# Altium schematic sheet 20_FPGA_Power.SchDoc: FPGA power
size A3; Organization: Lime Microsystems; Address1: Surrey Tech Centre; Address2: Guildford GU2 7YG; Address3: Surrey; Address4: United Kingdom; Revision: v1.0; SheetNumber: 20; SheetTotal: 31
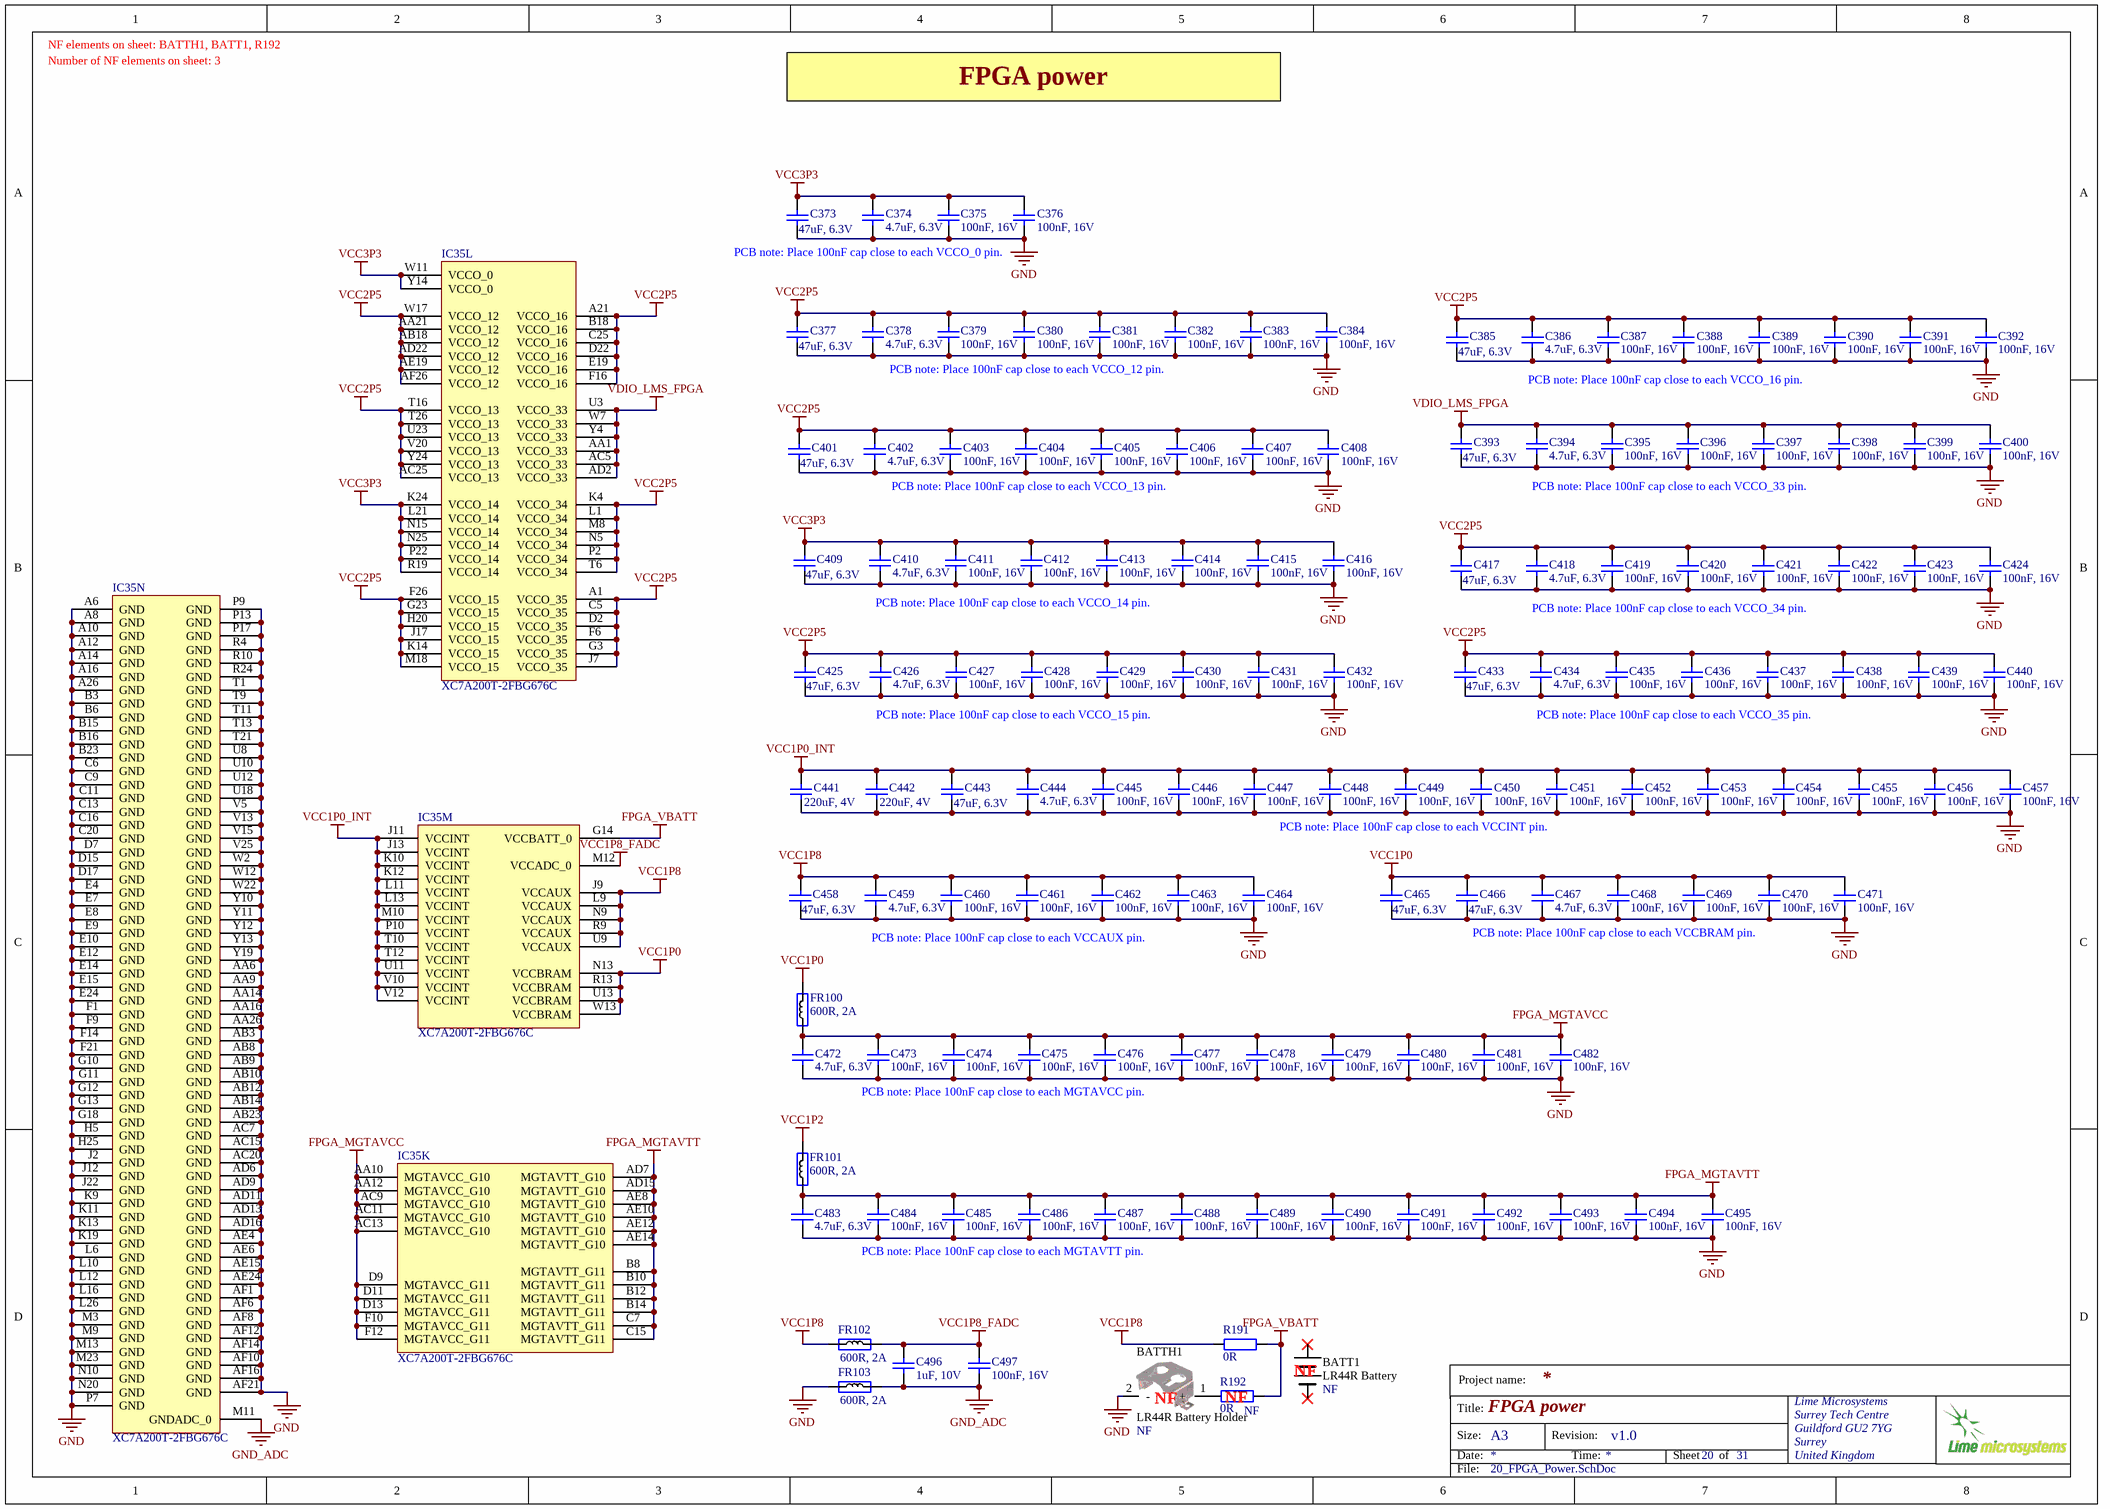
[diagram p0: 20_FPGA_Power.SchDoc]

## Parts
BATT1  LR44R Battery  Assembly Info: NF  (mechanical)
BATTH1  LR44R Battery Holder  Assembly Info: NF  [LR44R_BATTERY_HOLDER]
C373  47uF, 6.3V  [CAP1206]
C374  4.7uF, 6.3V  [CAP0402]
C375  100nF, 16V  [CAP0402]
C376  100nF, 16V  [CAP0402]
C377  47uF, 6.3V  [CAP1206]
C378  4.7uF, 6.3V  [CAP0402]
C379  100nF, 16V  [CAP0402]
C380  100nF, 16V  [CAP0402]
C381  100nF, 16V  [CAP0402]
C382  100nF, 16V  [CAP0402]
C383  100nF, 16V  [CAP0402]
C384  100nF, 16V  [CAP0402]
C385  47uF, 6.3V  [CAP1206]
C386  4.7uF, 6.3V  [CAP0402]
C387  100nF, 16V  [CAP0402]
C388  100nF, 16V  [CAP0402]
C389  100nF, 16V  [CAP0402]
C390  100nF, 16V  [CAP0402]
C391  100nF, 16V  [CAP0402]
C392  100nF, 16V  [CAP0402]
C393  47uF, 6.3V  [CAP1206]
C394  4.7uF, 6.3V  [CAP0402]
C395  100nF, 16V  [CAP0402]
C396  100nF, 16V  [CAP0402]
C397  100nF, 16V  [CAP0402]
C398  100nF, 16V  [CAP0402]
C399  100nF, 16V  [CAP0402]
C400  100nF, 16V  [CAP0402]
C401  47uF, 6.3V  [CAP1206]
C402  4.7uF, 6.3V  [CAP0402]
C403  100nF, 16V  [CAP0402]
C404  100nF, 16V  [CAP0402]
C405  100nF, 16V  [CAP0402]
C406  100nF, 16V  [CAP0402]
C407  100nF, 16V  [CAP0402]
C408  100nF, 16V  [CAP0402]
C409  47uF, 6.3V  [CAP1206]
C410  4.7uF, 6.3V  [CAP0402]
C411  100nF, 16V  [CAP0402]
C412  100nF, 16V  [CAP0402]
C413  100nF, 16V  [CAP0402]
C414  100nF, 16V  [CAP0402]
C415  100nF, 16V  [CAP0402]
C416  100nF, 16V  [CAP0402]
C417  47uF, 6.3V  [CAP1206]
C418  4.7uF, 6.3V  [CAP0402]
C419  100nF, 16V  [CAP0402]
C420  100nF, 16V  [CAP0402]
C421  100nF, 16V  [CAP0402]
C422  100nF, 16V  [CAP0402]
C423  100nF, 16V  [CAP0402]
C424  100nF, 16V  [CAP0402]
C425  47uF, 6.3V  [CAP1206]
C426  4.7uF, 6.3V  [CAP0402]
C427  100nF, 16V  [CAP0402]
C428  100nF, 16V  [CAP0402]
C429  100nF, 16V  [CAP0402]
C430  100nF, 16V  [CAP0402]
C431  100nF, 16V  [CAP0402]
C432  100nF, 16V  [CAP0402]
C433  47uF, 6.3V  [CAP1206]
C434  4.7uF, 6.3V  [CAP0402]
C435  100nF, 16V  [CAP0402]
C436  100nF, 16V  [CAP0402]
C437  100nF, 16V  [CAP0402]
C438  100nF, 16V  [CAP0402]
C439  100nF, 16V  [CAP0402]
C440  100nF, 16V  [CAP0402]
C441  220uF, 4V  [CAP1206]
C442  220uF, 4V  [CAP1206]
C443  47uF, 6.3V  [CAP1206]
C444  4.7uF, 6.3V  [CAP0402]
C445  100nF, 16V  [CAP0402]
C446  100nF, 16V  [CAP0402]
C447  100nF, 16V  [CAP0402]
C448  100nF, 16V  [CAP0402]
C449  100nF, 16V  [CAP0402]
C450  100nF, 16V  [CAP0402]
C451  100nF, 16V  [CAP0402]
C452  100nF, 16V  [CAP0402]
C453  100nF, 16V  [CAP0402]
C454  100nF, 16V  [CAP0402]
C455  100nF, 16V  [CAP0402]
C456  100nF, 16V  [CAP0402]
C457  100nF, 16V  [CAP0402]
C458  47uF, 6.3V  [CAP1206]
C459  4.7uF, 6.3V  [CAP0402]
C460  100nF, 16V  [CAP0402]
C461  100nF, 16V  [CAP0402]
C462  100nF, 16V  [CAP0402]
C463  100nF, 16V  [CAP0402]
C464  100nF, 16V  [CAP0402]
C465  47uF, 6.3V  [CAP1206]
C466  47uF, 6.3V  [CAP1206]
C467  4.7uF, 6.3V  [CAP0402]
C468  100nF, 16V  [CAP0402]
C469  100nF, 16V  [CAP0402]
C470  100nF, 16V  [CAP0402]
C471  100nF, 16V  [CAP0402]
C472  4.7uF, 6.3V  [CAP0402]
C473  100nF, 16V  [CAP0402]
C474  100nF, 16V  [CAP0402]
C475  100nF, 16V  [CAP0402]
C476  100nF, 16V  [CAP0402]
C477  100nF, 16V  [CAP0402]
C478  100nF, 16V  [CAP0402]
C479  100nF, 16V  [CAP0402]
C480  100nF, 16V  [CAP0402]
C481  100nF, 16V  [CAP0402]
C482  100nF, 16V  [CAP0402]
C483  4.7uF, 6.3V  [CAP0402]
C484  100nF, 16V  [CAP0402]
C485  100nF, 16V  [CAP0402]
C486  100nF, 16V  [CAP0402]
C487  100nF, 16V  [CAP0402]
C488  100nF, 16V  [CAP0402]
C489  100nF, 16V  [CAP0402]
C490  100nF, 16V  [CAP0402]
C491  100nF, 16V  [CAP0402]
C492  100nF, 16V  [CAP0402]
C493  100nF, 16V  [CAP0402]
C494  100nF, 16V  [CAP0402]
C495  100nF, 16V  [CAP0402]
C496  1uF, 10V  [CAP0402]
C497  100nF, 16V  [CAP0402]
FR100  600R, 2A  [RES0805]
FR101  600R, 2A  [RES0805]
FR102  600R, 2A  [RES0805]
FR103  600R, 2A  [RES0805]
IC35  XC7A200T-2FBG676C  [XC7A200T-2FBG676C_FBG676]  (parts K,L,M,N of 14)
R191  0R  [RES0402]
R192  0R  Assembly Info: NF  [RES0402]

## Nets
FPGA_MGTAVCC: C472.2 C473.1 C474.1 C475.1 C476.1 C477.1 C478.1 C479.1 C480.1 C481.1 C482.1 FR100.1 IC35.AA10(MGTAVCC_G10) IC35.AA12(MGTAVCC_G10) IC35.AC9(MGTAVCC_G10) IC35.AC11(MGTAVCC_G10) IC35.AC13(MGTAVCC_G10) IC35.D9(MGTAVCC_G11) IC35.D11(MGTAVCC_G11) IC35.D13(MGTAVCC_G11) IC35.F10(MGTAVCC_G11) IC35.F12(MGTAVCC_G11)
FPGA_MGTAVTT: C483.2 C484.1 C485.1 C486.1 C487.1 C488.1 C489.1 C490.1 C491.1 C492.1 C493.1 C494.1 C495.1 FR101.1 IC35.AD7(MGTAVTT_G10) IC35.AD15(MGTAVTT_G10) IC35.AE8(MGTAVTT_G10) IC35.AE10(MGTAVTT_G10) IC35.AE12(MGTAVTT_G10) IC35.AE14(MGTAVTT_G10) IC35.B8(MGTAVTT_G11) IC35.B10(MGTAVTT_G11) IC35.B12(MGTAVTT_G11) IC35.B14(MGTAVTT_G11) IC35.C7(MGTAVTT_G11) IC35.C15(MGTAVTT_G11)
FPGA_VBATT: IC35.G14(VCCBATT_0) R191.2 R192.2
GND: BATTH1.2(-) C373.1 C374.1 C375.2 C376.2 C377.1 C378.1 C379.2 C380.2 C381.2 C382.2 C383.2 C384.2 C385.1 C386.1 C387.2 C388.2 C389.2 C390.2 C391.2 C392.2 C393.1 C394.1 C395.2 C396.2 C397.2 C398.2 C399.2 C400.2 C401.1 C402.1 C403.2 C404.2 C405.2 C406.2 C407.2 C408.2 C409.1 C410.1 C411.2 C412.2 C413.2 C414.2 C415.2 C416.2 C417.1 C418.1 C419.2 C420.2 C421.2 C422.2 C423.2 C424.2 C425.1 C426.1 C427.2 C428.2 C429.2 C430.2 C431.2 C432.2 C433.1 C434.1 C435.2 C436.2 C437.2 C438.2 C439.2 C440.2 C441.1 C442.1 C443.1 C444.1 C445.2 C446.2 C447.2 C448.2 C449.2 C450.2 C451.2 C452.2 C453.2 C454.2 C455.2 C456.2 C457.2 C458.1 C459.1 C460.2 C461.2 C462.2 C463.2 C464.2 C465.1 C466.1 C467.1 C468.2 C469.2 C470.2 C471.2 C472.1 C473.2 C474.2 C475.2 C476.2 C477.2 C478.2 C479.2 C480.2 C481.2 C482.2 C483.1 C484.2 C485.2 C486.2 C487.2 C488.2 C489.2 C490.2 C491.2 C492.2 C493.2 C494.2 C495.2 FR103.1 IC35.A6(GND) IC35.A8(GND) IC35.A10(GND) IC35.A12(GND) IC35.A14(GND) IC35.A16(GND) IC35.A26(GND) IC35.AA6(GND) IC35.AA9(GND) IC35.AA14(GND) IC35.AA16(GND) IC35.AA26(GND) IC35.AB3(GND) IC35.AB8(GND) IC35.AB9(GND) IC35.AB10(GND) IC35.AB12(GND) IC35.AB14(GND) IC35.AB23(GND) IC35.AC7(GND) IC35.AC15(GND) IC35.AC20(GND) IC35.AD6(GND) IC35.AD9(GND) IC35.AD11(GND) IC35.AD13(GND) IC35.AD16(GND) IC35.AE4(GND) IC35.AE6(GND) IC35.AE15(GND) IC35.AE24(GND) IC35.AF1(GND) IC35.AF6(GND) IC35.AF8(GND) IC35.AF10(GND) IC35.AF12(GND) IC35.AF14(GND) IC35.AF16(GND) IC35.AF21(GND) IC35.B3(GND) IC35.B6(GND) IC35.B15(GND) IC35.B16(GND) IC35.B23(GND) IC35.C6(GND) IC35.C9(GND) IC35.C11(GND) IC35.C13(GND) IC35.C16(GND) IC35.C20(GND) IC35.D7(GND) IC35.D15(GND) IC35.D17(GND) IC35.E4(GND) IC35.E7(GND) IC35.E8(GND) IC35.E9(GND) IC35.E10(GND) IC35.E12(GND) IC35.E14(GND) IC35.E15(GND) IC35.E24(GND) IC35.F1(GND) IC35.F9(GND) IC35.F14(GND) IC35.F21(GND) IC35.G10(GND) IC35.G11(GND) IC35.G12(GND) IC35.G13(GND) IC35.G18(GND) IC35.H5(GND) IC35.H25(GND) IC35.J2(GND) IC35.J12(GND) IC35.J22(GND) IC35.K9(GND) IC35.K11(GND) IC35.K13(GND) IC35.K19(GND) IC35.L6(GND) IC35.L10(GND) IC35.L12(GND) IC35.L16(GND) IC35.L26(GND) IC35.M3(GND) IC35.M9(GND) IC35.M13(GND) IC35.M23(GND) IC35.N10(GND) IC35.N20(GND) IC35.P7(GND) IC35.P9(GND) IC35.P13(GND) IC35.P17(GND) IC35.R4(GND) IC35.R10(GND) IC35.R24(GND) IC35.T1(GND) IC35.T9(GND) IC35.T11(GND) IC35.T13(GND) IC35.T21(GND) IC35.U8(GND) IC35.U10(GND) IC35.U12(GND) IC35.U18(GND) IC35.V5(GND) IC35.V13(GND) IC35.V15(GND) IC35.V25(GND) IC35.W2(GND) IC35.W12(GND) IC35.W22(GND) IC35.Y10(GND) IC35.Y11(GND) IC35.Y12(GND) IC35.Y13(GND) IC35.Y19(GND)
GND_ADC: C496.1 C497.2 FR103.2 IC35.M11(GNDADC_0)
VCC1P0: C465.2 C466.2 C467.2 C468.1 C469.1 C470.1 C471.1 FR100.2 IC35.N13(VCCBRAM) IC35.R13(VCCBRAM) IC35.U13(VCCBRAM) IC35.W13(VCCBRAM)
VCC1P0_INT: C441.2 C442.2 C443.2 C444.2 C445.1 C446.1 C447.1 C448.1 C449.1 C450.1 C451.1 C452.1 C453.1 C454.1 C455.1 C456.1 C457.1 IC35.J11(VCCINT) IC35.J13(VCCINT) IC35.K10(VCCINT) IC35.K12(VCCINT) IC35.L11(VCCINT) IC35.L13(VCCINT) IC35.M10(VCCINT) IC35.P10(VCCINT) IC35.T10(VCCINT) IC35.T12(VCCINT) IC35.U11(VCCINT) IC35.V10(VCCINT) IC35.V12(VCCINT)
VCC1P2: FR101.2
VCC1P8: C458.2 C459.2 C460.1 C461.1 C462.1 C463.1 C464.1 FR102.1 IC35.J9(VCCAUX) IC35.L9(VCCAUX) IC35.N9(VCCAUX) IC35.R9(VCCAUX) IC35.U9(VCCAUX) R191.1
VCC1P8_FADC: C496.2 C497.1 FR102.2 IC35.M12(VCCADC_0)
VCC2P5: C377.2 C378.2 C379.1 C380.1 C381.1 C382.1 C383.1 C384.1 C385.2 C386.2 C387.1 C388.1 C389.1 C390.1 C391.1 C392.1 C401.2 C402.2 C403.1 C404.1 C405.1 C406.1 C407.1 C408.1 C417.2 C418.2 C419.1 C420.1 C421.1 C422.1 C423.1 C424.1 C425.2 C426.2 C427.1 C428.1 C429.1 C430.1 C431.1 C432.1 C433.2 C434.2 C435.1 C436.1 C437.1 C438.1 C439.1 C440.1 IC35.A1(VCCO_35) IC35.A21(VCCO_16) IC35.AA21(VCCO_12) IC35.AB18(VCCO_12) IC35.AC25(VCCO_13) IC35.AD22(VCCO_12) IC35.AE19(VCCO_12) IC35.AF26(VCCO_12) IC35.B18(VCCO_16) IC35.C5(VCCO_35) IC35.C25(VCCO_16) IC35.D2(VCCO_35) IC35.D22(VCCO_16) IC35.E19(VCCO_16) IC35.F6(VCCO_35) IC35.F16(VCCO_16) IC35.F26(VCCO_15) IC35.G3(VCCO_35) IC35.G23(VCCO_15) IC35.H20(VCCO_15) IC35.J7(VCCO_35) IC35.J17(VCCO_15) IC35.K4(VCCO_34) IC35.K14(VCCO_15) IC35.L1(VCCO_34) IC35.M8(VCCO_34) IC35.M18(VCCO_15) IC35.N5(VCCO_34) IC35.P2(VCCO_34) IC35.T6(VCCO_34) IC35.T16(VCCO_13) IC35.T26(VCCO_13) IC35.U23(VCCO_13) IC35.V20(VCCO_13) IC35.W17(VCCO_12) IC35.Y24(VCCO_13)
VCC3P3: C373.2 C374.2 C375.1 C376.1 C409.2 C410.2 C411.1 C412.1 C413.1 C414.1 C415.1 C416.1 IC35.K24(VCCO_14) IC35.L21(VCCO_14) IC35.N15(VCCO_14) IC35.N25(VCCO_14) IC35.P22(VCCO_14) IC35.R19(VCCO_14) IC35.W11(VCCO_0) IC35.Y14(VCCO_0)
VDIO_LMS_FPGA: C393.2 C394.2 C395.1 C396.1 C397.1 C398.1 C399.1 C400.1 IC35.AA1(VCCO_33) IC35.AC5(VCCO_33) IC35.AD2(VCCO_33) IC35.U3(VCCO_33) IC35.W7(VCCO_33) IC35.Y4(VCCO_33)
NetBATTH1_1: BATTH1.1(+) R192.1

Not connected (* = marked no-connect by the designer): BATT1 NEGATIVE* POSITIVE*

## Notes on the sheet
- NF elements on sheet: BATTH1, BATT1, R192
- Number of NF elements on sheet: 3
- FPGA power
- PCB note: Place 100nF cap close to each VCCO_0 pin.
- PCB note: Place 100nF cap close to each VCCO_12 pin.
- PCB note: Place 100nF cap close to each VCCO_16 pin.
- PCB note: Place 100nF cap close to each VCCO_13 pin.
- PCB note: Place 100nF cap close to each VCCO_33 pin.
- PCB note: Place 100nF cap close to each VCCO_14 pin.
- PCB note: Place 100nF cap close to each VCCO_34 pin.
- PCB note: Place 100nF cap close to each VCCO_15 pin.
- PCB note: Place 100nF cap close to each VCCO_35 pin.
- PCB note: Place 100nF cap close to each VCCINT pin.
- PCB note: Place 100nF cap close to each VCCAUX pin.
- PCB note: Place 100nF cap close to each VCCBRAM pin.
- PCB note: Place 100nF cap close to each MGTAVCC pin.
- PCB note: Place 100nF cap close to each MGTAVTT pin.
- (near BATT1) NF
- (near BATTH1) NF
- (near R192) NF
- Project name:
- Title:
- Size:
- Date:
- A3
- Revision:
- Time:
- Sheet
- of
- File:

## Library data of the parts
BATT1 = LR44R_BATTERY: Part Description: Coin, 11.6mm Alkaline Manganese Dioxide 1.5 V Battery Non-Rechargeable (Primary); Manufacturer: Murata; ComponentLink1URL: http://na.industrial.panasonic.com/sites/default/pidsa/files/crseries_datasheets_merged.pdf; ComponentLink1Description: http://na.industrial.panasonic.com/sites/default/pidsa/files/crseries_datasheets_merged.pdf; Supplier 1: DigiKey; Supplier Part Number 1: 490-LR44R-ND; Manufacturer Part Number 1: LR44R; Stock 1: 1754; Pricing 1: 1=0,71000, 10=0,59200, 50=0,51660, 100=0,48880, 250=0,45272, 500=0,42774, 1000=0,40274, 2500=0,37496, 5000=0,35552 (USD)
BATTH1 = LR44R_BATTERY_HOLDER: Part Description: Battery Retainer Coin, 11.6mm 1 Cell SMD (SMT) Tab; Manufacturer: Keystone Electronics; Manufacturer Part Number 1: 2996; Number of Batteries: 1; ComponentLink1URL: http://na.industrial.panasonic.com/sites/default/pidsa/files/crseries_datasheets_merged.pdf; ComponentLink1Description: http://na.industrial.panasonic.com/sites/default/pidsa/files/crseries_datasheets_merged.pdf; Supplier 1: Digi-Key; Supplier Part Number 1: 36-2996-ND; Stock 1: 11716; Pricing 1: 1=0,39000, 25=0,32720, 100=0,27070, 250=0,24944, 500=0,23438, 1000=0,21935, 2500=0,19929, 5000=0,18550 (USD); RoHS: Yes; Mount: Surface Mount,PCB; Case/Package: SMD/SMT; Color: Silver; Contact Material: Bronze; Contact Plating: Tin; Package Quantity: 100; Termination: SMD/SMT; Series: -; Number of Cells: 1; REACH SVHC: No SVHC; Lead Free: Lead Free; ComponentLink2URL: https://datasheet.ciiva.com/18491/2996-18491290.pdf?src-supplier=Digi-Key; ComponentLink2Description: https://datasheet.ciiva.com/18491/2996-18491290.pdf?src-supplier=Digi-Key
C373 C377 C385 C393 C401 C409 C417 C425 C433 C443 C458 C465 C466 = Cap_1206: Manufacturer: Samsung Electro-Mechanics; Manufacturer Part Number: CL31A476MQHNNNE; Part Description: 47µF ±20% 6.3V Ceramic Capacitor X5R 1206 (3216 Metric); Notification: Current market demand for these product types have resulted in fluctuating and extending lead times. Lead times may differ.; Temperature Coefficient: X5R; Tolerance: ±20%; Thickness (Max): 0.071" (1.80mm); Height - Seated (Max): -; Operating Temperature: -55°C ~ 85°C; Lead Style: -; Package / Case: 1206 (3216 Metric); Size / Dimension: 0.126" L x 0.063" W (3.20mm x 1.60mm); Applications: General Purpose; Ratings: -; Mounting Type: Surface Mount, MLCC; Voltage - Rated: 6.3V; Lead Spacing: -; Features: -; Supplier Part Number 1: 1276-1167-1-ND; RoHS: RoHS Compliant; Category: Capacitors; Supplier 1: Digi-Key; Packaging: Cut Tape (CT); Part Status: Active; Value: 47uF, 6.3V; Manufacturer Part Number 1: CL31A476MQHNNNE
C374 C378 C386 C394 C402 C410 C418 C426 C434 C444 C459 C467 C472 C483 = Cap_0402: Manufacturer: Murata Electronics North America; Part Description: 4.7µF ±20% 6.3V X5R Ceramic Capacitor -55°C ~ 85°C Surface Mount, MLCC 0402 (1005 Metric) 0.039" L x 0.020" W (1.00mm x 0.50mm); Manufacturer Part Number 1: GRM155R60J475ME87D; Tolerance: ±20%; Capacitance: 4.7µF; Temperature Coefficient: X5R; Lead Style: -; Ratings: -; Height - Seated (Max): -; Thickness (Max): 0.022" (0.55mm); Voltage - Rated: 6.3V; Packaging: Cut Tape (CT); Lead Spacing: -; Category: Capacitors; Supplier Part Number 1: 490-5408-1-ND; Applications: General Purpose; Operating Temperature: -55°C ~ 85°C; Mounting Type: Surface Mount, MLCC; Features: Derating Recommended; RoHS: RoHS Compliant; Supplier 1: Digi-Key; Package / Case: 0402 (1005 Metric); Size / Dimension: 0.039" L x 0.020" W (1.00mm x 0.50mm); Value: 4.7uF, 6.3V
C375 C376 C379-C384 C387-C392 C395-C400 C403-C408 C411-C416 C419-C424 C427-C432 C435-C440 C445-C457 C460-C464 C468-C471 C473-C482 C484-C495 C497 = Cap_0402: Manufacturer: Murata Electronics; Manufacturer Part Number 1: GRM155R71C104KA88D; Part Description: 0.10µF ±10% 16V X7R Ceramic Capacitor -55°C ~ 125°C Surface Mount, MLCC 0402 (1005 Metric) 0.039" L x 0.020" W (1.00mm x 0.50mm); Tolerance: 10 %; Type: General Purpose MLCC; Capacitance: 0.1 uF; Case Length: 1 mm; Dielectric: X7R; Case Height: 0.5 mm; Temperature Coefficient / Code: +/- 15 %; Value: 100nF, 16V; Supplier 1: Mouser; Supplier Part Number 1: 81-GRM155R71C104KA88; Case Code - in: 0402; RoHS: RoHS Compliant; Operating Temperature Range: - 55 C to + 125 C; Series: GRM; Termination Style: SMD/SMT; Package / Case: 0402 (1005 metric); Voltage Rating DC: 16 V; Maximum Operating Temperature: + 125 C; Case Code - mm: 1005; Minimum Operating Temperature: - 55 C; Product Category: Low & Medium Capacitance SMD Ceramic Chip Capacitors; Packaging: Reel; Product: General Type MLCCs; Category: Multilayer Ceramic Capacitors MLCC - SMD/SMT; Brand: Murata Electronics; Case Width: 0.5 mm; RoHS - Mouser: Y; Standard Pack Qty: 10000; Minimum Order Quantity: 1; Reeling: True
C441 C442 = Cap_1206: Manufacturer Part Number 1: GRM31CR60G227ME11L; Manufacturer: Murata Electronics North America; Part Description: 220µF ±20% 4V Ceramic Capacitor X5R 1206 (3216 Metric); Capacitance: 220µF; Temperature Coefficient: X5R; Tolerance: ±20%; Package / Case: 1206 (3216 Metric); Supplier 1: Digi-Key; Packaging: Cut Tape (CT); Size / Dimension: 0.126" L x 0.063" W (3.20mm x 1.60mm); Operating Temperature: -55°C ~ 85°C; Voltage - Rated: 4V; Mounting Type: Surface Mount, MLCC; Ratings: -; Supplier Part Number 1: 490-9774-1-ND; Category: Capacitors; Lead Spacing: -; Lead Style: -; Applications: General Purpose; Features: -; Height - Seated (Max): -; Thickness (Max): 0.075" (1.90mm); RoHS: RoHS Compliant; Value: 220uF, 4V
C496 = Cap_0402: Manufacturer Part Number 1: C1005X5R1E105K050BC; Manufacturer: TDK; Part Description: 1µF ±10% 10V X5R Ceramic Capacitor -55°C ~ 85°C Surface Mount, MLCC 0402 (1005 Metric) 0.039" L x 0.020" W (1.00mm x 0.50mm); Voltage Rating: 10; Capacitance Tolerance: ± 10%; Product Range: TDK - C Series; Ceramic Capacitor Case: 0402 [1005 Metric]; Capacitance: 1; Dielectric Characteristic: X6; Value: 1uF, 10V; Supplier 1: Digi-Key; Supplier Part Number 1: 445-9066-1-ND; MSL: -; RoHS: YES
FR100-FR103 = Ferrite: Manufacturer Part Number 1: MPZ2012S601AT000; Manufacturer: TDK Corporation; Part Description: FERRITE BEAD 600 OHM 0805 1LN; Filter Type: Differential Mode - Single; Impedance @ Frequency: 600 Ohm @ 100MHz; DC Resistance (DCR): 100 mOhm Max; Supplier 1: Digi-Key; Supplier Part Number 1: 445-2206-2-ND; Mounting Type: Surface Mount; RoHS: RoHS Compliant; Height (Max): 0.041" (1.05mm); Packaging: Tape & Reel (TR); Category: Filters; Current Rating: 2A; Package / Case: 0805 (2012 Metric); Size / Dimension: 0.079" L x 0.049" W (2.00mm x 1.25mm); Value: 600R, 2A
IC35 = XC7A200T-2FBG676C: Artix-7 FPGA, 400 User I/Os, 8 GTP, 676-Ball BGA, Speed Grade 2, Commercial Grade, Pb-Free; Manufacturer: Xilinx; Part Description: IC FPGA 400 I/O 676FCBGA; Speed Grade: -2; Number of Logic Blocks (LABs): 16825; Number of Logic Elements/Cells: 215360; RAM Size: 13455360b; Number of I/Os: 400; Number of Registers: 269200; Memory Type: DDR3; Memory Size: 1GB; Max Supply Voltage: 1.05V; Min Supply Voltage: 950mV; ComponentLink1Description: Manufacturer URL; ComponentLink1URL: http://www.xilinx.com/; ComponentLink2Description: Datasheet; ComponentLink2URL: http://www.xilinx.com/support/documentation/data_sheets/ds180_7Series_Overview.pdf; ComponentLink3Description: Package Specification; ComponentLink3URL: http://www.xilinx.com/support/documentation/user_guides/ug475_7Series_Pkg_Pinout.pdf; ComponentLink4Description: DC and Switching Characteristics; ComponentLink4URL: http://www.xilinx.com/support/documentation/data_sheets/ds181_Artix_7_Data_Sheet.pdf; ComponentLink5Description: Package File; ComponentLink5URL: http://www.xilinx.com/support/packagefiles/a7packages/xc7a200tfbg676pkg.txt; ComponentLink6Description: Packaging and Pinout; ComponentLink6URL: http://www.xilinx.com/support/documentation/user_guides/ug475_7Series_Pkg_Pinout.pdf; Supplier 1: Digi-Key; Supplier Part Number 1: 122-1865-ND; Manufacturer Part Number 1: XC7A200T-2FBG676C; Stock 1: 124; Pricing 1: 1=261,30000 (USD); RoHS: Yes; Case/Package: FCBGA; Number of Pins: 676; Contact Plating: Copper,Tin,Silver; Min Operating Temperature: 0°C; Max Operating Temperature: 85°C; ComponentLink7URL: https://datasheet.ciiva.com/15066/ds181-artix-7-data-sheet-15066344.pdf?src-supplier=Digi-Key; ComponentLink7Description: https://datasheet.ciiva.com/15066/ds181-artix-7-data-sheet-15066344.pdf?src-supplier=Digi-Key; ComponentLink8URL: https://datasheet.ciiva.com/48475/ds180-7series-overview-48475947.pdf?src-supplier=Avnet; ComponentLink8Description: https://datasheet.ciiva.com/48475/ds180-7series-overview-48475947.pdf?src-supplier=Avnet
R191 R192 = Res_0402: Manufacturer Part Number 1: RC0402JR-070RL; Manufacturer: Yageo; Part Description: RES SMD 0.0OHM JUMPER 1/16W 0402; Resistance (Ohms): 0.0; Tolerance: Jumper; Power (Watts): 0.063W, 1/16W; Value: 0R; Supplier 1: Digi-Key; Supplier Part Number 1: 311-0.0JRTR-ND; Category: Resistors; Temperature Coefficient: -; Features: Moisture Resistant; Supplier Device Package: 0402; Height: 0.016" (0.40mm); Package / Case: 0402 (1005 Metric); Operating Temperature: -55°C ~ 155°C; Size / Dimension: 0.039" L x 0.020" W (1.00mm x 0.50mm); Composition: Thick Film; Packaging: Tape & Reel (TR); Number of Terminations: 2; RoHS: RoHS Compliant